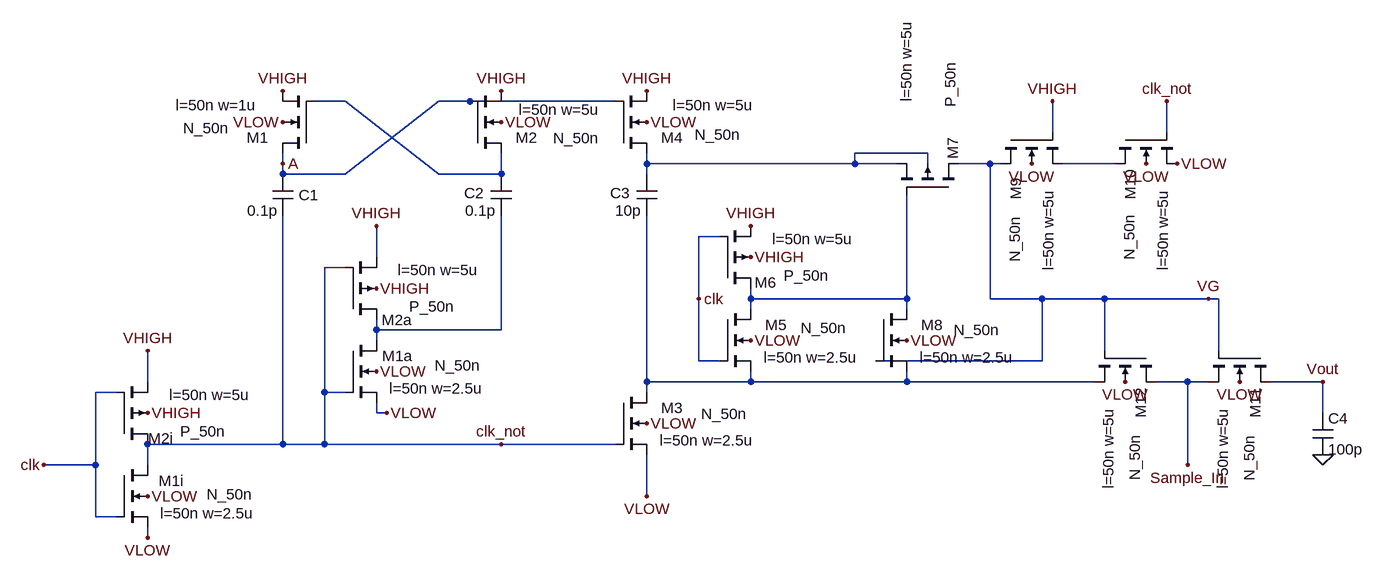
[diagram p0: schematic sample_hold_2.asc]
sample_hold_2.asc, the LTspice schematic file:
Version 4
SHEET 1 2864 680
WIRE 704 -704 656 -704
WIRE 896 -704 848 -704
WIRE 1120 -704 896 -704
WIRE 1792 -656 1792 -704
WIRE 1968 -656 1968 -704
WIRE 1600 -624 1488 -624
WIRE 608 -608 608 -624
WIRE 1168 -608 1168 -624
WIRE 1488 -608 1488 -624
WIRE 1488 -608 1168 -608
WIRE 1552 -608 1488 -608
WIRE 1600 -608 1600 -624
WIRE 1696 -608 1648 -608
WIRE 1712 -608 1696 -608
WIRE 1888 -608 1808 -608
WIRE 608 -592 608 -608
WIRE 704 -592 848 -704
WIRE 704 -592 608 -592
WIRE 848 -592 704 -704
WIRE 944 -592 944 -624
WIRE 944 -592 848 -592
WIRE 1168 -592 1168 -608
WIRE 1280 -496 1248 -496
WIRE 752 -464 752 -512
WIRE 704 -448 672 -448
WIRE 1248 -400 1248 -496
WIRE 1328 -400 1328 -416
WIRE 1568 -400 1568 -560
WIRE 1568 -400 1328 -400
WIRE 1696 -400 1696 -608
WIRE 1776 -400 1696 -400
WIRE 1872 -400 1776 -400
WIRE 2032 -400 1872 -400
WIRE 2048 -400 2032 -400
WIRE 1328 -384 1328 -400
WIRE 1568 -384 1568 -400
WIRE 752 -352 752 -368
WIRE 944 -352 944 -528
WIRE 944 -352 752 -352
WIRE 752 -336 752 -352
WIRE 1872 -320 1872 -400
WIRE 2048 -320 2048 -400
WIRE 1248 -304 1248 -400
WIRE 1280 -304 1248 -304
WIRE 1776 -304 1776 -400
WIRE 1776 -304 1520 -304
WIRE 400 -272 400 -320
WIRE 1168 -272 1168 -528
WIRE 1328 -272 1328 -288
WIRE 1328 -272 1168 -272
WIRE 1568 -272 1568 -288
WIRE 1568 -272 1328 -272
WIRE 1856 -272 1568 -272
WIRE 2000 -272 1952 -272
WIRE 2032 -272 2000 -272
WIRE 2208 -272 2128 -272
WIRE 352 -256 320 -256
WIRE 672 -256 672 -448
WIRE 704 -256 672 -256
WIRE 1168 -256 1168 -272
WIRE 752 -224 752 -240
WIRE 768 -224 752 -224
WIRE 2208 -224 2208 -272
WIRE 608 -176 608 -528
WIRE 608 -176 400 -176
WIRE 672 -176 672 -256
WIRE 672 -176 608 -176
WIRE 944 -176 672 -176
WIRE 1120 -176 944 -176
WIRE 320 -144 320 -256
WIRE 320 -144 240 -144
WIRE 400 -144 400 -176
WIRE 2000 -144 2000 -272
WIRE 1168 -96 1168 -160
WIRE 320 -64 320 -144
WIRE 352 -64 320 -64
WIRE 400 -32 400 -48
FLAG 608 -608 A
FLAG 2208 -272 Vout
FLAG 400 -96 VLOW
FLAG 400 -32 VLOW
FLAG 768 -224 VLOW
FLAG 752 -288 VLOW
FLAG 608 -672 VLOW
FLAG 944 -672 VLOW
FLAG 1168 -672 VLOW
FLAG 1168 -208 VLOW
FLAG 1168 -96 VLOW
FLAG 1328 -336 VLOW
FLAG 1568 -336 VLOW
FLAG 1760 -608 VLOW
FLAG 1936 -608 VLOW
FLAG 1984 -608 VLOW
FLAG 1904 -272 VLOW
FLAG 2080 -272 VLOW
FLAG 608 -720 VHIGH
FLAG 944 -720 VHIGH
FLAG 1168 -720 VHIGH
FLAG 1792 -704 VHIGH
FLAG 1328 -512 VHIGH
FLAG 752 -512 VHIGH
FLAG 400 -320 VHIGH
FLAG 1328 -464 VHIGH
FLAG 400 -224 VHIGH
FLAG 752 -416 VHIGH
FLAG 2000 -144 Sample_In
FLAG 2208 -160 0
FLAG 1248 -400 clk
FLAG 1968 -704 clk_not
FLAG 240 -144 clk
FLAG 944 -176 clk_not
FLAG 2032 -400 VG
SYMBOL nmos4 352 -144 R0
WINDOW 0 104 24 Right 2
WINDOW 3 210 45 Right 2
WINDOW 123 213 74 Right 2
SYMATTR InstName M1i
SYMATTR Value N_50n
SYMATTR Value2 l=50n w=2.5u
SYMBOL pmos4 352 -176 M180
WINDOW 0 88 9 Right 2
WINDOW 3 168 20 Right 2
WINDOW 123 206 76 Right 2
SYMATTR InstName M2i
SYMATTR Value P_50n
SYMATTR Value2 l=50n w=5u
SYMBOL cap 960 -528 R180
WINDOW 0 42 35 Left 2
WINDOW 3 24 8 Left 2
SYMATTR InstName C2
SYMATTR Value 0.1p
SYMBOL nmos4 704 -336 R0
WINDOW 0 104 24 Right 2
WINDOW 3 209 39 Right 2
WINDOW 123 213 74 Right 2
SYMATTR InstName M1a
SYMATTR Value N_50n
SYMATTR Value2 l=50n w=2.5u
SYMBOL pmos4 704 -368 M180
WINDOW 0 103 -1 Right 2
WINDOW 3 168 20 Right 2
WINDOW 123 206 76 Right 2
SYMATTR InstName M2a
SYMATTR Value P_50n
SYMATTR Value2 l=50n w=5u
SYMBOL cap 624 -528 R180
WINDOW 0 -39 32 Left 2
WINDOW 3 24 8 Left 2
SYMATTR InstName C1
SYMATTR Value 0.1p
SYMBOL nmos4 896 -624 M180
WINDOW 0 104 24 Right 2
WINDOW 3 199 23 Right 2
WINDOW 123 200 67 Right 2
SYMATTR InstName M2
SYMATTR Value N_50n
SYMATTR Value2 l=50n w=5u
SYMBOL nmos4 656 -624 R180
WINDOW 0 104 24 Right 2
WINDOW 3 201 39 Right 2
WINDOW 123 213 74 Right 2
SYMATTR InstName M1
SYMATTR Value N_50n
SYMATTR Value2 l=50n w=1u
SYMBOL cap 1184 -528 R180
WINDOW 0 42 35 Left 2
WINDOW 3 24 8 Left 2
SYMATTR InstName C3
SYMATTR Value 10p
SYMBOL nmos4 1120 -256 R0
WINDOW 0 104 24 Right 2
WINDOW 3 203 33 Right 2
WINDOW 123 213 74 Right 2
SYMATTR InstName M3
SYMATTR Value N_50n
SYMATTR Value2 l=50n w=2.5u
SYMBOL nmos4 1120 -624 M180
WINDOW 0 104 24 Right 2
WINDOW 3 193 29 Right 2
WINDOW 123 213 74 Right 2
SYMATTR InstName M4
SYMATTR Value N_50n
SYMATTR Value2 l=50n w=5u
SYMBOL nmos4 1280 -384 R0
WINDOW 0 104 24 Right 2
WINDOW 3 196 29 Right 2
WINDOW 123 213 74 Right 2
SYMATTR InstName M5
SYMATTR Value N_50n
SYMATTR Value2 l=50n w=2.5u
SYMBOL pmos4 1280 -416 M180
WINDOW 0 88 9 Right 2
WINDOW 3 168 20 Right 2
WINDOW 123 206 76 Right 2
SYMATTR InstName M6
SYMATTR Value P_50n
SYMATTR Value2 l=50n w=5u
SYMBOL nmos4 1520 -384 R0
WINDOW 0 104 24 Right 2
WINDOW 3 191 32 Right 2
WINDOW 123 213 74 Right 2
SYMATTR InstName M8
SYMATTR Value N_50n
SYMATTR Value2 l=50n w=2.5u
SYMBOL nmos4 1712 -656 M90
WINDOW 0 104 24 Right 2
WINDOW 3 200 22 Right 2
WINDOW 123 213 74 Right 2
SYMATTR InstName M9
SYMATTR Value N_50n
SYMATTR Value2 l=50n w=5u
SYMBOL nmos4 1888 -656 M90
WINDOW 0 104 24 Right 2
WINDOW 3 197 22 Right 2
WINDOW 123 213 74 Right 2
SYMATTR InstName M10
SYMATTR Value N_50n
SYMATTR Value2 l=50n w=5u
SYMBOL nmos4 2128 -320 R90
WINDOW 0 104 24 Right 2
WINDOW 3 201 33 Right 2
WINDOW 123 213 74 Right 2
SYMATTR InstName M11
SYMATTR Value N_50n
SYMATTR Value2 l=50n w=5u
SYMBOL nmos4 1952 -320 R90
WINDOW 0 104 24 Right 2
WINDOW 3 200 33 Right 2
WINDOW 123 213 74 Right 2
SYMATTR InstName M12
SYMATTR Value N_50n
SYMATTR Value2 l=50n w=5u
SYMBOL cap 2192 -224 R0
SYMATTR InstName C4
SYMATTR Value 100p
SYMBOL pmos4 1648 -560 M270
WINDOW 0 88 9 Right 2
WINDOW 3 204 13 Right 2
WINDOW 123 268 81 Right 2
SYMATTR InstName M7
SYMATTR Value P_50n
SYMATTR Value2 l=50n w=5u

The netlist it stands for:
* sample_hold_2.asc
M1i clk_not clk VLOW VLOW N_50n l=50n w=2.5u
M2i clk_not clk VHIGH VHIGH P_50n l=50n w=5u
C2 N005 N001 0.1p
M1a N005 clk_not VLOW VLOW N_50n l=50n w=2.5u
M2a N005 clk_not VHIGH VHIGH P_50n l=50n w=5u
C1 clk_not A 0.1p
M2 N001 A VHIGH VLOW N_50n l=50n w=5u
M1 A N001 VHIGH VLOW N_50n l=50n w=1u
C3 N006 N002 10p
M3 N006 clk_not VLOW VLOW N_50n l=50n w=2.5u
M4 N002 A VHIGH VLOW N_50n l=50n w=5u
M5 N004 clk N006 VLOW N_50n l=50n w=2.5u
M6 N004 clk VHIGH VHIGH P_50n l=50n w=5u
M8 N004 VG N006 VLOW N_50n l=50n w=2.5u
M9 VG VHIGH N003 VLOW N_50n l=50n w=5u
M10 N003 clk_not VLOW VLOW N_50n l=50n w=5u
M11 Vout VG Sample_In VLOW N_50n l=50n w=5u
M12 Sample_In VG N006 VLOW N_50n l=50n w=5u
C4 Vout 0 100p
M7 VG N004 N002 N002 P_50n l=50n w=5u
.model NMOS NMOS
.model PMOS PMOS
.lib standard.mos
.backanno
.end